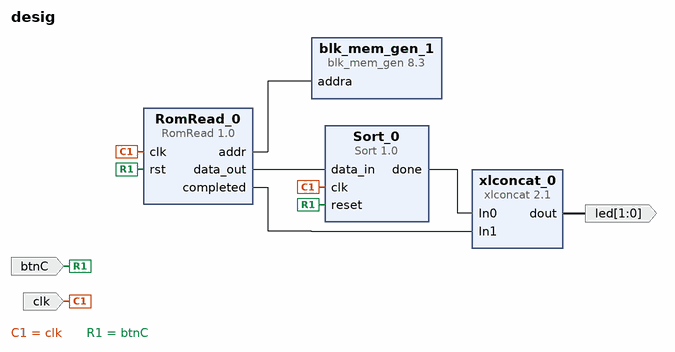
[diagram p0: block diagram of the top level]
# Vivado block design desig, xc7a100tcsg324-1, Vivado 2016.4
create_bd_design desig

create_bd_port -dir I clk
create_bd_port -dir I btnC
create_bd_port -dir O -from 1 -to 0 led

create_bd_cell -type ip -vlnv xilinx.com:user:Sort:1.0 Sort_0
set_property -dict {CONFIG.words 512 CONFIG.size 32} [get_bd_cells Sort_0]
create_bd_cell -type ip -vlnv xilinx.com:user:RomRead:1.0 RomRead_0
set_property -dict {CONFIG.address_bits 9} [get_bd_cells RomRead_0]
create_bd_cell -type ip -vlnv xilinx.com:ip:xlconcat:2.1 xlconcat_0
create_bd_cell -type ip -vlnv xilinx.com:ip:blk_mem_gen:8.3 blk_mem_gen_1
set_property -dict [list \
  CONFIG.Memory_Type Single_Port_RAM \
  CONFIG.Enable_32bit_Address false \
  CONFIG.Use_Byte_Write_Enable false \
  CONFIG.Operating_Mode_A READ_FIRST \
  CONFIG.Enable_A Always_Enabled \
  CONFIG.Register_PortA_Output_of_Memory_Primitives false \
  CONFIG.Load_Init_File true \
  CONFIG.Coe_File ../../../../../../../mul.coe \
  CONFIG.Use_RSTA_Pin false \
  CONFIG.Port_A_Write_Rate 50 \
  CONFIG.Disable_Collision_Warnings true \
  CONFIG.use_bram_block Stand_Alone \
] [get_bd_cells blk_mem_gen_1]

# ---- connections ----

connect_bd_net [get_bd_pins RomRead_0/data_out] [get_bd_pins Sort_0/data_in]
connect_bd_net [get_bd_ports clk] [get_bd_pins RomRead_0/clk] [get_bd_pins Sort_0/clk]
connect_bd_net [get_bd_pins Sort_0/done] [get_bd_pins xlconcat_0/In0]
connect_bd_net [get_bd_pins RomRead_0/completed] [get_bd_pins xlconcat_0/In1]
connect_bd_net [get_bd_pins xlconcat_0/dout] [get_bd_ports led]
connect_bd_net [get_bd_ports btnC] [get_bd_pins RomRead_0/rst] [get_bd_pins Sort_0/reset]
connect_bd_net [get_bd_pins RomRead_0/addr] [get_bd_pins blk_mem_gen_1/addra]

validate_bd_design
save_bd_design
